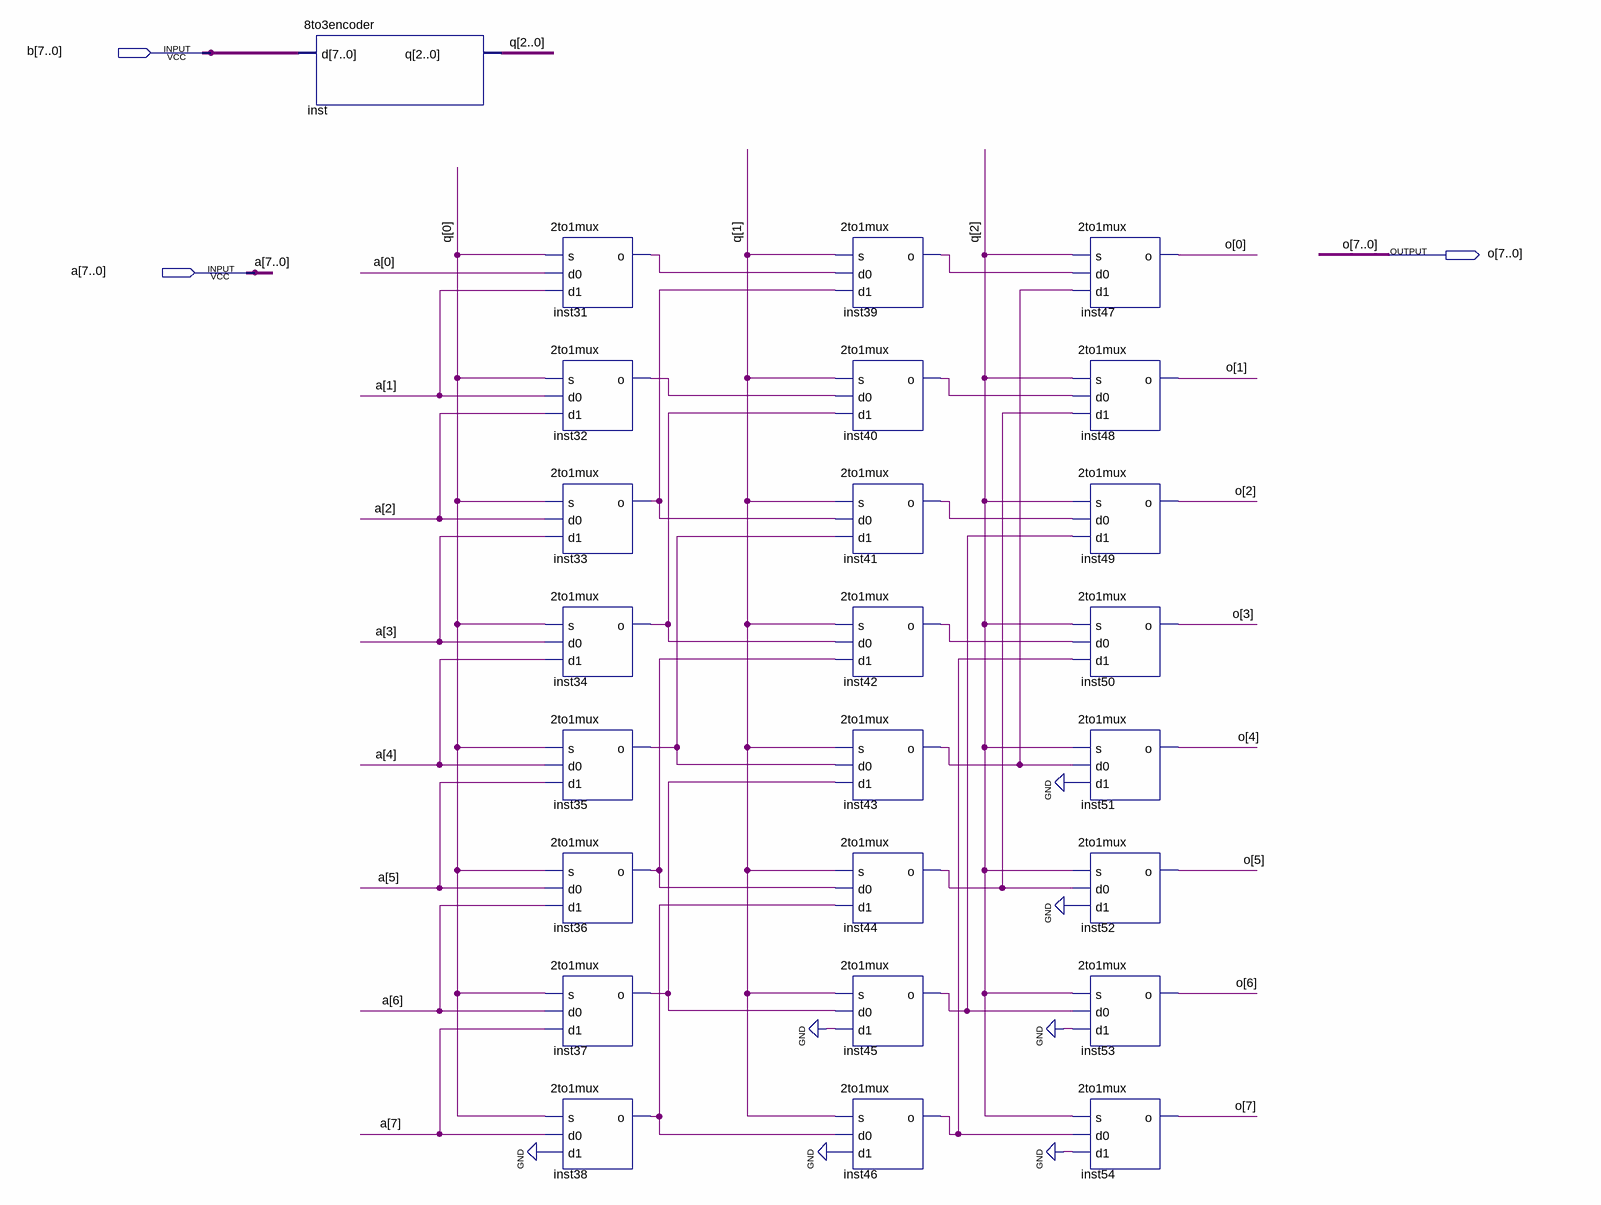
[diagram p0: schematic sheet]
// Quartus schematic rightlogicshifter.bdf as structural Verilog: 25 symbols, 3 pins
module rightlogicshifter (
  input  [7:0] b,
  input  [7:0] a,
  output [7:0] o
);

  wire inst31_o, inst32_o, inst33_o, inst34_o, inst35_o, inst36_o, inst37_o, inst38_o, inst39_o, inst40_o,
       inst41_o, inst42_o, inst43_o, inst44_o, inst45_o, inst46_o;
  wire [2:0] q;

  \8to3encoder  inst (.d(b), .q(q));
  \2to1mux  inst31 (.s(q[0]), .d0(a[0]), .d1(a[1]), .o(inst31_o));
  \2to1mux  inst32 (.s(q[0]), .d0(a[1]), .d1(a[2]), .o(inst32_o));
  \2to1mux  inst33 (.s(q[0]), .d0(a[2]), .d1(a[3]), .o(inst33_o));
  \2to1mux  inst34 (.s(q[0]), .d0(a[3]), .d1(a[4]), .o(inst34_o));
  \2to1mux  inst35 (.s(q[0]), .d0(a[4]), .d1(a[5]), .o(inst35_o));
  \2to1mux  inst36 (.s(q[0]), .d0(a[5]), .d1(a[6]), .o(inst36_o));
  \2to1mux  inst37 (.s(q[0]), .d0(a[6]), .d1(a[7]), .o(inst37_o));
  \2to1mux  inst38 (.s(q[0]), .d0(a[7]), .d1(1'b0), .o(inst38_o));
  \2to1mux  inst39 (.s(q[1]), .d0(inst31_o), .d1(inst33_o), .o(inst39_o));
  \2to1mux  inst40 (.s(q[1]), .d0(inst32_o), .d1(inst34_o), .o(inst40_o));
  \2to1mux  inst41 (.s(q[1]), .d0(inst33_o), .d1(inst35_o), .o(inst41_o));
  \2to1mux  inst42 (.s(q[1]), .d0(inst34_o), .d1(inst36_o), .o(inst42_o));
  \2to1mux  inst43 (.s(q[1]), .d0(inst35_o), .d1(inst37_o), .o(inst43_o));
  \2to1mux  inst44 (.s(q[1]), .d0(inst36_o), .d1(inst38_o), .o(inst44_o));
  \2to1mux  inst45 (.s(q[1]), .d0(inst37_o), .d1(1'b0), .o(inst45_o));
  \2to1mux  inst46 (.s(q[1]), .d0(inst38_o), .d1(1'b0), .o(inst46_o));
  \2to1mux  inst47 (.s(q[2]), .d0(inst39_o), .d1(inst43_o), .o(o[0]));
  \2to1mux  inst48 (.s(q[2]), .d0(inst40_o), .d1(inst44_o), .o(o[1]));
  \2to1mux  inst49 (.s(q[2]), .d0(inst41_o), .d1(inst45_o), .o(o[2]));
  \2to1mux  inst50 (.s(q[2]), .d0(inst42_o), .d1(inst46_o), .o(o[3]));
  \2to1mux  inst51 (.s(q[2]), .d0(inst43_o), .d1(1'b0), .o(o[4]));
  \2to1mux  inst52 (.s(q[2]), .d0(inst44_o), .d1(1'b0), .o(o[5]));
  \2to1mux  inst53 (.s(q[2]), .d0(inst45_o), .d1(1'b0), .o(o[6]));
  \2to1mux  inst54 (.s(q[2]), .d0(inst46_o), .d1(1'b0), .o(o[7]));
endmodule
